# EAGLE design wireless_temp (EAGLE 6.1)
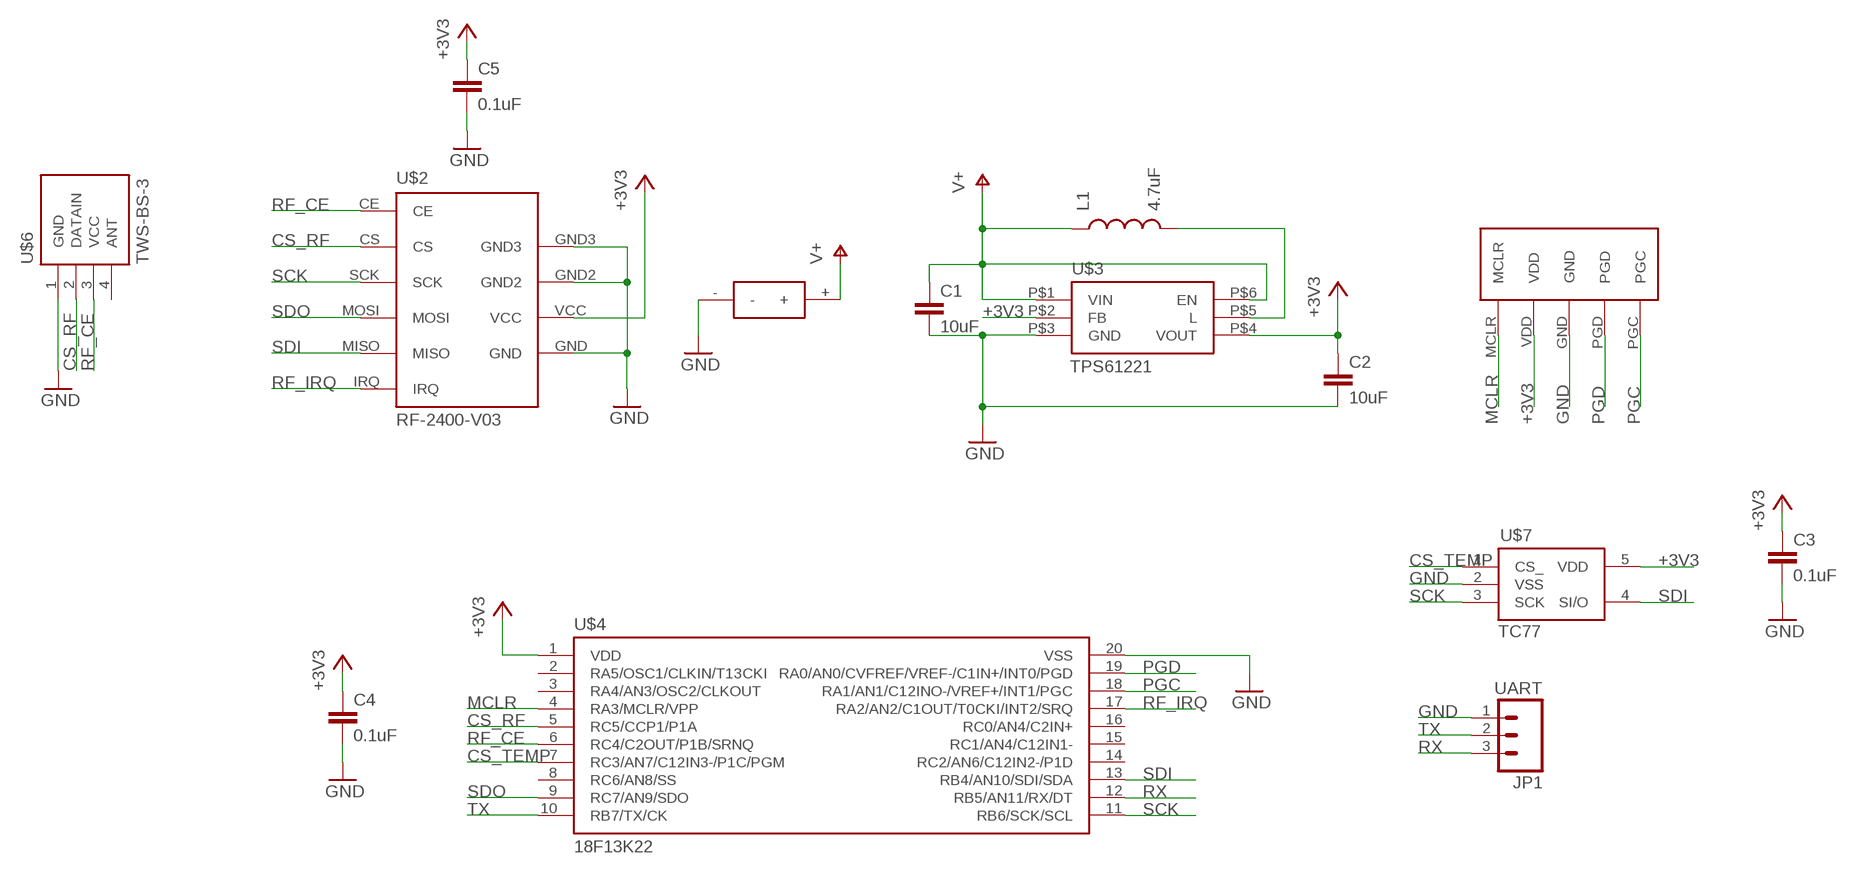
[diagram p0: schematic, sheet 1]

## Parts
C1  10uF  CAP0805  [0805]
C2  10uF  CAP0805  [0805]
C3  0.1uF  CAP0402-CAP  [0402-CAP]
C4  0.1uF  CAP0402-CAP  [0402-CAP]
C5  0.1uF  CAP0402-CAP  [0402-CAP]
JP1  UART  M03PTH  [1X03]
L1  4.7uF  INDUCTOR  [NR3015T]
U$1  BAT_HOLDER  [AAA]
U$2  RF-2400-V03  [RF-2400-V03]
U$3  TPS61221  [SO6]
U$4  18F13K22  [SSOP20]
U$5  PIC-ICSP  [ICSP]
U$6  TWS-BS-3  [TWS-BS-3]
U$7  TC77  [SOT23-5]

## Nets
+3V3: C2.1 C3.1 C4.1 C5.1 U$2.VCC U$3.P$2(FB) U$3.P$4(VOUT) U$4.1(VDD) U$5.VDD U$7.5(VDD)
CS_RF: U$2.CS U$4.5(RC5/CCP1/P1A) U$6.2(DATAIN)
CS_TEMP: U$4.7(RC3/AN7/C12IN3-/P1C/PGM) U$7.1(CS_)
GND: C1.2 C2.2 C3.2 C4.2 C5.2 JP1.1 U$1.- U$2.GND U$2.GND2 U$2.GND3 U$3.P$3(GND) U$4.20(VSS) U$5.GND U$6.1(GND) U$7.2(VSS)
MCLR: U$4.4(RA3/MCLR/VPP) U$5.MCLR
N$1: L1.P$2 U$3.P$5(L)
PGC: U$4.18(RA1/AN1/C12INO-/VREF+/INT1/PGC) U$5.PGC
PGD: U$4.19(RA0/AN0/CVFREF/VREF-/C1IN+/INT0/PGD) U$5.PGD
RF_CE: U$2.CE U$4.6(RC4/C2OUT/P1B/SRNQ) U$6.3(VCC)
RF_IRQ: U$2.IRQ U$4.17(RA2/AN2/C1OUT/T0CKI/INT2/SRQ)
RX: JP1.3 U$4.12(RB5/AN11/RX/DT)
SCK: U$2.SCK U$4.11(RB6/SCK/SCL) U$7.3(SCK)
SDI: U$2.MISO U$4.13(RB4/AN10/SDI/SDA) U$7.4(SI/O)
SDO: U$2.MOSI U$4.9(RC7/AN9/SDO)
TX: JP1.2 U$4.10(RB7/TX/CK)
V+: C1.1 L1.P$1 U$1.+ U$3.P$1(VIN) U$3.P$6(EN)
Unconnected: U$4.2(RA5/OSC1/CLKIN/T13CKI) U$4.3(RA4/AN3/OSC2/CLKOUT) U$4.8(RC6/AN8/SS) U$4.14(RC2/AN6/C12IN2-/P1D) U$4.15(RC1/AN4/C12IN1-) U$4.16(RC0/AN4/C2IN+) U$6.4(ANT)

## Library data of the parts
C1-C5 = SparkFun:CAP: Capacitor Standard 0603 ceramic capacitor, and 0.1" leaded capacitor.
JP1 = SparkFun:M03: Header 3 Standard 3-pin 0.1" header. Use with straight break away headers (SKU : PRT-00116), right angle break away headers (PRT-00553), swiss pins (PRT-00743), machine pins (PRT-00117), and female headers (PRT-00115). Molex polarized connector foot print use with SKU : PRT-08232 with associated crimp pins and housings.
L1 = sak:INDUCTOR: Inductors Basic Inductor/Choke - 0603 and 1206. Footprints are not proven and vary greatly between part numbers.
U$1 = sak:BAT_HOLDER
U$2 = sak:RF-2400-V03
U$3 = sak:TPS61221
U$4 = sak:18F13K22
U$5 = sak:PIC-ICSP
U$6 = sak:TWS-BS-3
U$7 = sak:TC77

## Board
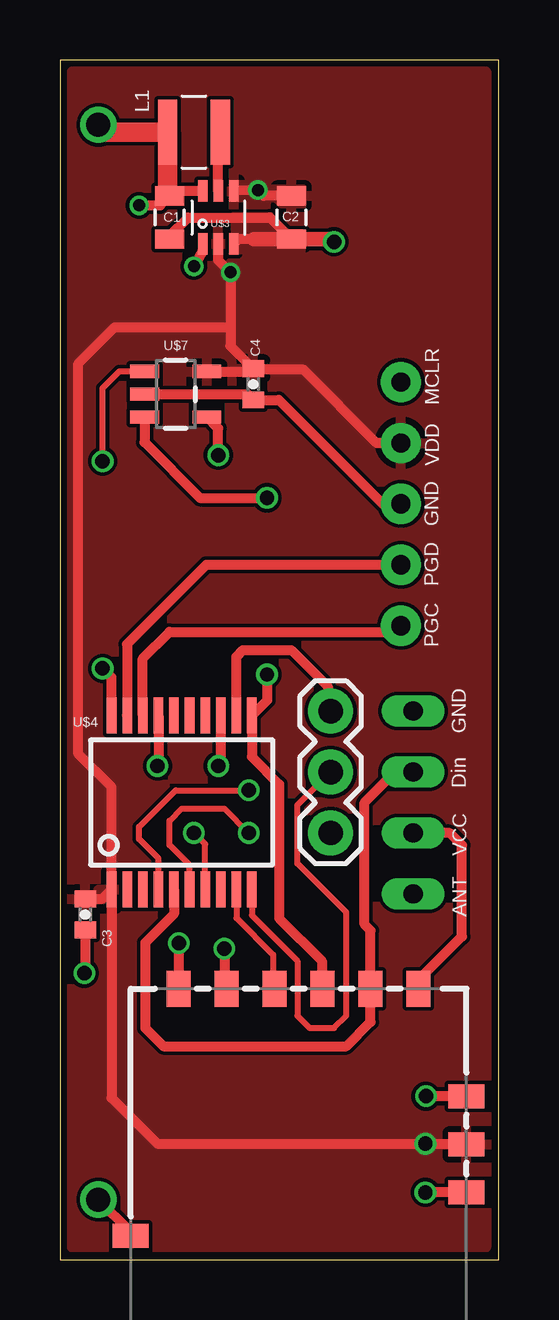
[diagram p1: board, top side]
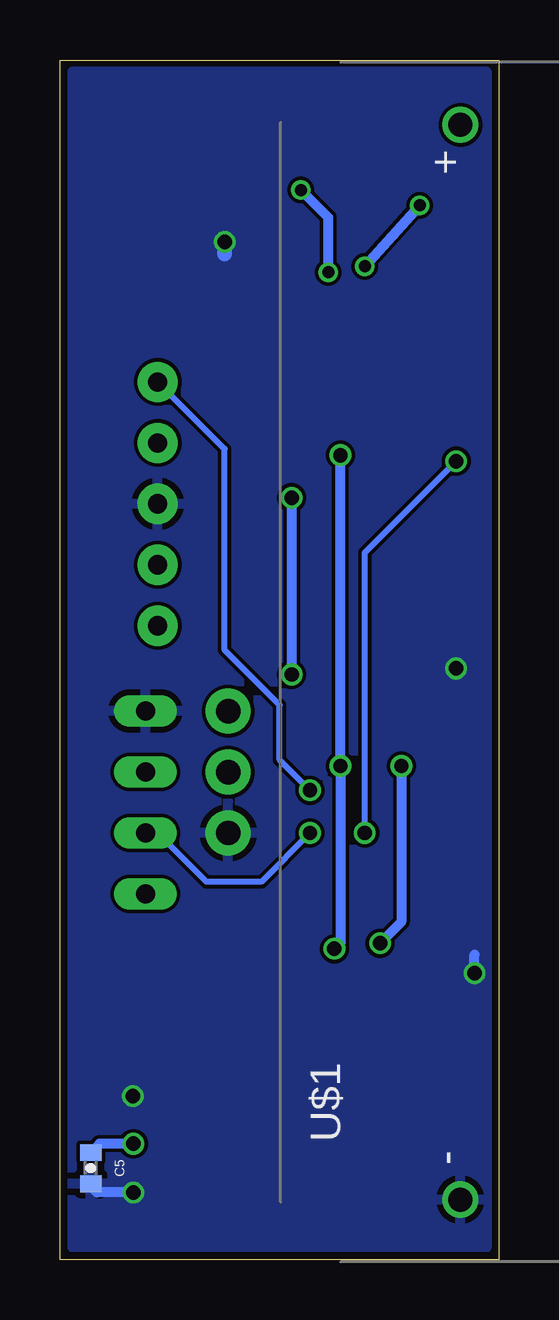
[diagram p2: board, bottom side, seen from below]

Size 18.3 x 50 mm. Coordinates in mm from the lower left corner, seen from the top.
Outline: 0,0 18.3,0 18.3,50 0,50 0,0
Copper layers (1*16): Top 0.035mm / dielectric 1.5mm / Bottom 0.035mm
Design rules: minimum track width 6mil, minimum drill 12mil, track to track 6mil, track to pad 6mil, pad to pad 6mil, via to via 6mil, smd to smd 0mil, copper to edge 10mil, drill to drill 10mil, minimum pad ring 10mil, minimum via ring 6mil, stop-mask expansion 2mil, vias tented up to drill 100mil, thermal gap 10mil

### Footprints (pad centres in the part's own frame; a part is rotated, then mirrored left to right if it is on the bottom)
0805 = smd 0.8 x 1.2: 1 -0.9,0; 2 0.9,0
0402-CAP = smd 0.7 x 0.9: 1 -0.65,0; 2 0.65,0
1X03 = drill 1.016 pad 1.88: 1 0,0; 2 2.54,0; 3 5.08,0
NR3015T = smd 0.8 x 2.7: P$1 -1.1,0; P$2 1.1,0
AAA = drill 1: + 22.4,0; - -22.4,0
RF-2400-V03 = smd 1.5 x 1: CE 10,-5; CS 10,-3; IRQ 10,5; MISO 10,3; MOSI 10,1; SCK 10,-1 | smd 1 x 1.5: GND 5.507,-7; GND2 1.507,-7; GND3 -0.3,7; VCC 3.507,-7
SO6 = smd 0.4 x 0.9: P$1 -0.65,-1.1; P$2 0,-1.1; P$3 0.65,-1.1; P$4 0.65,1.1; P$5 0,1.1; P$6 -0.65,1.1
SSOP20 = smd 0.4 x 1.5: 1 -2.925,-3.625; 2 -2.275,-3.625; 3 -1.625,-3.625; 4 -0.975,-3.625; 5 -0.325,-3.625; 6 0.325,-3.625; 7 0.975,-3.625; 8 1.625,-3.625; 9 2.275,-3.625; 10 2.925,-3.625; 11 2.925,3.625; 12 2.275,3.625; 13 1.625,3.625; 14 0.975,3.625; 15 0.325,3.625; 16 -0.325,3.625; 17 -0.975,3.625; 18 -1.625,3.625; 19 -2.275,3.625; 20 -2.925,3.625
ICSP = drill 0.8 pad 1.676: GND 0,0; MCLR -5.08,0; PGC 5.08,0; PGD 2.54,0; VDD -2.54,0
TWS-BS-3 = drill 0.8 long: 1 -3.81,0; 2 -1.27,0; 3 1.27,0; 4 3.81,0
SOT23-5 = smd 0.55 x 1.2: 1 -0.95,-1.3; 2 0,-1.3; 3 0.95,-1.3; 4 0.95,1.3; 5 -0.95,1.3

### Placement (x,y rotation side)
C1  4.57,43.43 270 top
C2  9.65,43.43 270 top
C3  1.06,14.38 270 top
C4  8.06,36.48 270 top
C5  17.02,3.81 270 bottom
JP1  11.28,17.78 90 top
L1  5.59,46.99 0 top
U$1  1.6,24.9 90 bottom
U$2  9.95,1.29 90 top
U$3  6.6,43.43 0 top
U$4  5.08,19.05 0 top
U$5  14.22,31.5 270 top
U$6  14.73,19.05 270 top
U$7  4.83,36.07 270 top

### Tracks (layer width: path | path; a pad name or v marks a point on that pad's centre or on a via)
+3V3  (via drill 0.5, 0.6)
  Top 0.406: U$3.P$2 6.6,41.66 v7.11,41.15 7.11,38.86 | 7.26,44.55 v8.26,44.58 8.5,44.33 C2.1 | U$2.VCC 15.27,4.79 v15.24,4.83 4.06,4.83 2.15,6.74 U$4.1 | C3.1 1.76,15.03 U$4.1 | U$7.5 7.95,37.02 C4.1 | 7.11,38.86 7.11,38.08 C4.1 | U$4.1 2.15,19.69 0.76,21.08 0.76,37.34 2.29,38.86 7.11,38.86 | U$5.VDD 13.21,34.04 10.16,37.08 8.11,37.08 C4.1
  Bottom 0.406: v7.11,41.15 7.11,43.43 v8.26,44.58 | v15.24,4.83 16.65,4.83 C5.1
  pour Top (no thermals): 7.19,44.2 8.97,44.2 9.22,43.94 10.16,43.94 10.16,44.68 8.61,44.68 8.43,44.86 7.19,44.86
  pour Top: 0.51,49.53 17.78,49.53 17.78,0.51 0.51,0.51
CS_RF
  Top 0.406: U$4.5 4.75,14.41 3.56,13.21 3.56,9.65 4.32,8.89 11.94,8.89 12.95,9.91 U$2.CS 12.95,13.72 12.7,13.97 12.7,19.05 13.97,20.32 U$6.2
CS_TEMP  (via drill 0.6)
  Top 0.254: U$7.1 2.47,37.02 1.78,36.32 v1.78,33.27 | U$4.7 6.05,17.31 v5.59,17.78
  Bottom 0.254: v5.59,17.78 5.59,29.46 v1.78,33.27
GND  (via drill 0.6)
  Top 0.406: U$3.P$3 7.45,42.53 8.09,42.53 C2.2 8.75,43.43 5.33,43.43 4.57,42.67 C1.2 | U$2.GND2 v15.24,2.79 | U$2.GND3 2.95,1.15 U$1.- | C3.2 1.06,11.98 v1.02,11.94 | U$7.2 7.83,36.07 C4.2 9.13,35.83 13.46,31.5 U$5.GND | U$4.20 2.15,24.26 v1.78,24.64 | U$2.GND 15.28,6.79 v15.27,6.81
  Top 0.61: 8.09,42.53 11.31,42.53 v11.43,42.42
  Bottom 0.406: v15.24,2.79 16.76,2.79 17.02,3.05 | v1.02,11.94 1.02,12.7 | v1.78,24.64 1.52,24.64 | v15.27,6.81 15.34,6.81 15.37,6.78
  Bottom 0.61: v11.43,42.42 11.43,41.91
  pour Top (no thermals): 7.24,42.04 10.13,42.04 10.13,42.82 9.5,42.82 8.79,43.54 7.24,43.54
  pour Bottom: 17.78,0.51 17.78,49.53 0.51,49.53 0.51,0.51
MCLR  (via drill 0.6)
  Top 0.254: U$4.4 4.11,16.72 3.3,17.53 3.3,18.03 4.83,19.56 v7.87,19.56
  Bottom 0.254: v7.87,19.56 9.14,20.83 9.14,23.11 11.43,25.4 11.43,33.78 U$5.MCLR
N$1
  Top 0.406: U$3.P$5 6.6,46.91 L1.P$2
PGC
  Top 0.406: U$4.18 3.46,25.05 4.57,26.16 13.97,26.16 U$5.PGC
PGD
  Top 0.406: U$5.PGD 6.1,28.96 2.79,25.65 2.79,22.69 U$4.19
RF_CE  (via drill 0.6)
  Top 0.254: U$4.6 5.41,16.44 4.57,17.27 4.57,18.29 5.08,18.8 6.86,18.8 v7.87,17.78
  Top 0.406: U$2.CE 14.95,11.65 16.76,13.46 16.76,17.27 16.26,17.78 U$6.3
  Bottom 0.254: v7.87,17.78 9.91,15.75 12.19,15.75 14.22,17.78 U$6.3
RF_IRQ  (via drill 0.6)
  Top 0.406: U$4.17 4.11,20.61 v4.06,20.57 | v4.95,13.18 U$2.IRQ
  Bottom 0.406: v4.06,20.57 4.06,14.07 v4.95,13.18
RX
  Top 0.406: U$4.12 7.36,25.14 7.62,25.4 9.65,25.4 11.18,23.88 11.18,22.97 JP1.3
SCK  (via drill 0.6)
  Top 0.406: U$2.SCK 10.92,11.32 10.92,12.45 9.14,14.22 9.14,19.81 8.01,20.95 U$4.11 8.64,23.31 v8.64,24.38 | U$7.3 3.53,34.07 5.84,31.75 v8.64,31.75
  Bottom 0.406: v8.64,31.75 v8.64,24.38
SDI  (via drill 0.6)
  Top 0.406: U$4.13 6.71,20.68 v6.6,20.57 | v6.86,12.95 6.86,11.38 U$2.MISO | v6.6,33.53 6.6,34.64 U$7.4
  Bottom 0.406: v6.86,12.95 6.6,13.21 v6.6,20.57 v6.6,33.53
SDO
  Top 0.254: U$4.9 7.36,14.23 8.89,12.7 8.89,11.35
  Top 0.406: 8.89,11.35 U$2.MOSI
TX
  Top 0.254: U$4.10 8.01,14.35 9.91,12.45 9.91,10.16 10.41,9.65 11.43,9.65 11.94,10.16 11.94,14.48 9.91,16.51 9.91,18.94 JP1.2
V+  (via drill 0.5)
  Top 0.406: U$3.P$6 4.77,44.53 C1.1 4.18,43.94 v3.3,43.94 | U$3.P$1 5.95,42.02 v5.59,41.4
  Top 0.813: C1.1 4.49,44.42 L1.P$1 1.6,46.99 U$1.+
  Bottom 0.406: v5.59,41.4 v3.3,43.94